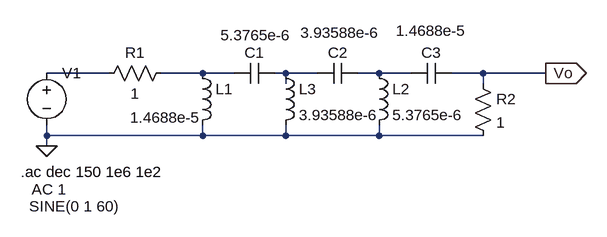
[diagram p0: schematic PassaAltasLCnorm.asc]
PassaAltasLCnorm.asc, the LTspice schematic file:
Version 4
SHEET 1 1832 680
WIRE 192 64 96 64
WIRE 336 64 272 64
WIRE 384 64 336 64
WIRE 464 64 448 64
WIRE 512 64 464 64
WIRE 608 64 576 64
WIRE 656 64 608 64
WIRE 768 64 720 64
WIRE 864 64 768 64
WIRE 464 80 464 64
WIRE 768 80 768 64
WIRE 96 160 96 144
WIRE 336 160 336 144
WIRE 336 160 96 160
WIRE 464 160 464 144
WIRE 464 160 336 160
WIRE 608 160 608 144
WIRE 608 160 464 160
WIRE 768 160 608 160
WIRE 96 176 96 160
FLAG 864 64 Vo
IOPIN 864 64 Out
FLAG 96 176 0
SYMBOL voltage 96 48 R0
WINDOW 123 -23 195 Left 2
WINDOW 39 0 0 Left 0
WINDOW 3 -27 221 Left 2
SYMATTR Value2 AC 1
SYMATTR Value SINE(0 1 60)
SYMATTR InstName V1
SYMBOL res 288 48 R90
WINDOW 0 0 56 VBottom 2
WINDOW 3 32 56 VTop 2
SYMATTR InstName R1
SYMATTR Value 1
SYMBOL res 752 64 R0
SYMATTR InstName R2
SYMATTR Value 1
SYMBOL cap 448 48 R90
WINDOW 0 0 32 VBottom 2
WINDOW 3 -58 30 VTop 2
SYMATTR InstName C1
SYMATTR Value 5.3765e-6
SYMBOL cap 576 48 R90
WINDOW 0 0 32 VBottom 2
WINDOW 3 -62 28 VTop 2
SYMATTR InstName C2
SYMATTR Value 3.93588e-6
SYMBOL cap 720 48 R90
WINDOW 0 0 32 VBottom 2
WINDOW 3 -65 32 VTop 2
SYMATTR InstName C3
SYMATTR Value 1.4688e-5
SYMBOL ind 320 48 R0
WINDOW 3 -96 84 Left 2
SYMATTR Value 1.4688e-5
SYMATTR InstName L1
SYMBOL ind 592 48 R0
SYMATTR InstName L2
SYMATTR Value 5.3765e-6
SYMBOL ind 448 48 R0
SYMATTR InstName L3
SYMATTR Value 3.93588e-6
TEXT 56 216 Left 2 !.ac dec 150 1e6 1e2

The netlist it stands for:
* PassaAltasLCnorm.asc
V1 N001 0 SINE(0 1 60) AC 1
R1 N002 N001 1
R2 Vo 0 1
C1 N003 N002 5.3765e-6
C2 N004 N003 3.93588e-6
C3 Vo N004 1.4688e-5
L1 N002 0 1.4688e-5
L2 N004 0 5.3765e-6
L3 N003 0 3.93588e-6
.ac dec 150 1e6 1e2
.backanno
.end